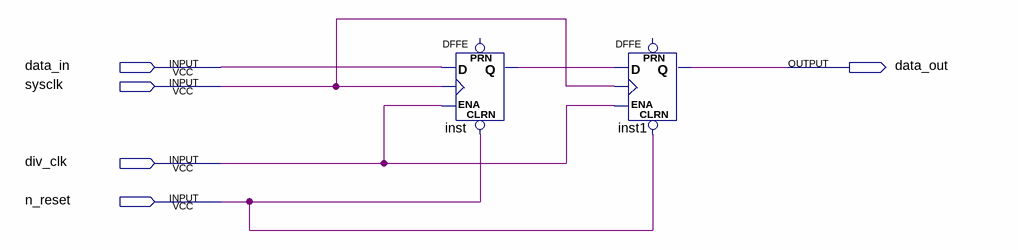
[diagram p0: schematic sheet]
// Quartus schematic debouncer_altera.bdf as structural Verilog: 2 symbols, 5 pins
module debouncer_altera (
  input  data_in,
  input  sysclk,
  input  div_clk,
  input  n_reset,
  output data_out
);

  wire inst_q;

  DFFE inst (.CLRN(n_reset), .D(data_in), .CLK(sysclk), .ENA(div_clk), .Q(inst_q));  // open: PRN
  DFFE inst1 (.CLRN(n_reset), .D(inst_q), .CLK(sysclk), .ENA(div_clk), .Q(data_out));  // open: PRN
endmodule
